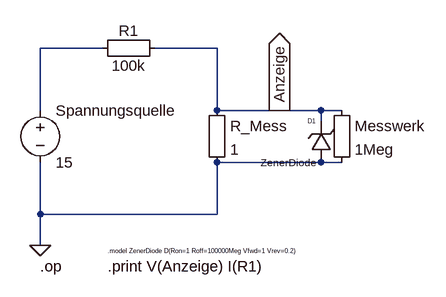
[diagram p0: schematic V1 Strommesser.asc]
V1 Strommesser.asc, the LTspice schematic file:
Version 4
SHEET 1 920 680
WIRE -64 64 -160 64
WIRE 112 64 16 64
WIRE -160 160 -160 64
WIRE 112 160 112 64
WIRE 208 160 112 160
WIRE 272 160 208 160
WIRE 304 160 272 160
WIRE 272 176 272 160
WIRE 272 240 112 240
WIRE 304 240 272 240
WIRE -160 320 -160 240
WIRE 112 320 112 240
WIRE 112 320 -160 320
WIRE -160 368 -160 320
FLAG -160 368 0
FLAG 208 160 Anzeige
IOPIN 208 160 Out
SYMBOL Misc\\EuropeanResistor 96 144 R0
SYMATTR InstName R_Mess
SYMATTR Value 1
SYMBOL Misc\\EuropeanResistor 288 144 R0
SYMATTR InstName Messwerk
SYMATTR Value 1Meg
SYMBOL voltage -160 144 R0
SYMATTR InstName Spannungsquelle
SYMATTR Value 15
SYMBOL Misc\\EuropeanResistor -80 80 R270
WINDOW 0 27 56 VTop 2
WINDOW 3 5 56 VBottom 2
SYMATTR InstName R1
SYMATTR Value 100k
SYMBOL zener 288 240 R180
WINDOW 0 24 64 Left 0
WINDOW 3 24 0 Left 1
SYMATTR InstName D1
SYMATTR Value ZenerDiode
TEXT -160 400 Left 2 !.op
TEXT -56 400 Left 2 !.print V(Anzeige) I(R1)
TEXT -56 376 Left 0 !.model ZenerDiode D(Ron=1 Roff=100000Meg Vfwd=1 Vrev=0.2)

The netlist it stands for:
* V1 Strommesser.asc
R_Mess Anzeige 0 1
R§Messwerk Anzeige 0 1Meg
V§Spannungsquelle N001 0 15
R1 N001 Anzeige 100k
D1 0 Anzeige ZenerDiode
.model D D
.lib standard.dio
.op
.print V(Anzeige) I(R1)
.model ZenerDiode D(Ron=1 Roff=100000Meg Vfwd=1 Vrev=0.2)
.backanno
.end